# Altium schematic sheet Control_and_inputs.SchDoc: Control System - pi3 Electronic PetFeeder
size A4; DrawnBy: ByDansouza
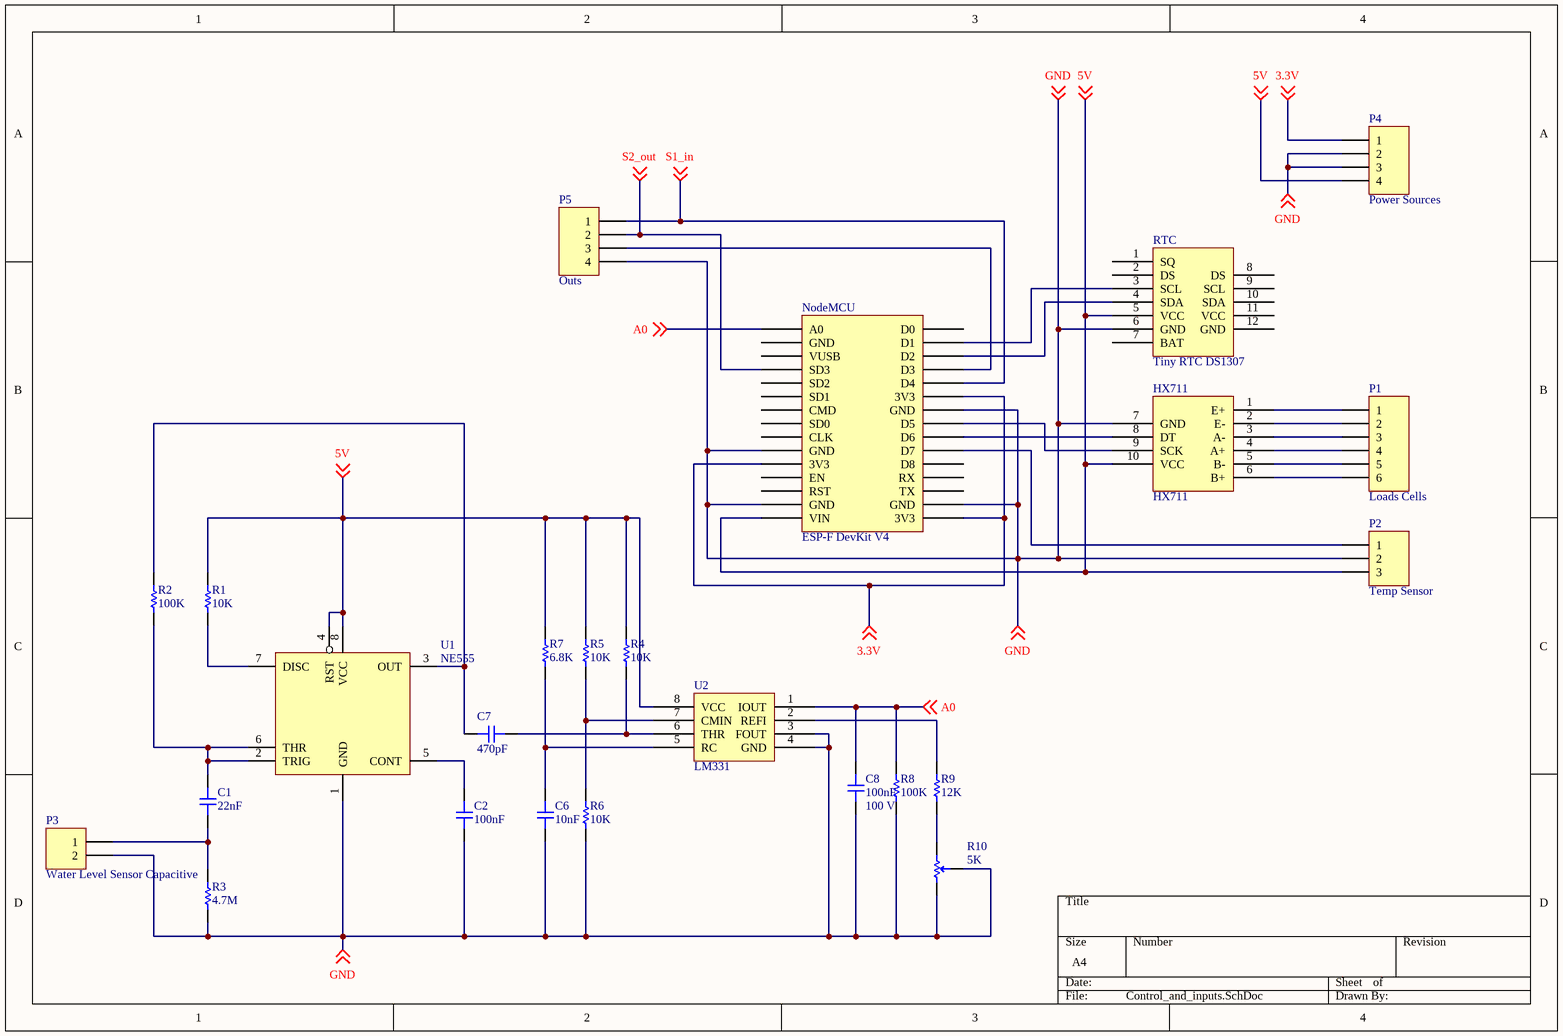
[diagram p0: Control_and_inputs.SchDoc]

## Parts
C1  22nF  [C200-350-150]
C2  100nF  [C200-350-150]
C6  10nF  [C200-350-150]
C7  470pF  [C200-350-150]
C8  100nF  Voltage: 100 V  [C200-350-150]
HX711  HX711  [HX711]
NodeMCU  ESP-F DevKit V4  [LoLin (+ NodeMCU)]
P1  Loads Cells  [KRE_6]
P2  Temp Sensor  [KRE_3]
P3  Water Level Sensor Capacitive  [KRE_2]
P4  Power Sources  [KRE_4]
P5  Outs  [KRE_4]
R1  10K  [R400-2.0mm]
R2  100K  [R400-2.0mm]
R3  4.7M  [R400-2.0mm]
R4  10K  [R400-2.0mm]
R5  10K  [R400-2.0mm]
R6  10K  [R400-2.0mm]
R7  6.8K  [R400-2.0mm]
R8  100K  [R400-2.0mm]
R9  12K  [R400-2.0mm]
R10  5K  [Trimpot-3260W]
RTC  Tiny RTC DS1307  [TinyRTC]
U1  NE555  [DIP08-300(100)]
U2  LM331  [DIP08-300(100)]

## Nets
3.3V: NodeMCU.3V3 P4.1 ; off-sheet 3.3V
5V: HX711.10(VCC) NodeMCU.VIN P2.3 P4.4 R1.2 R4.2 R5.2 R7.2 RTC.5(VCC) U1.4(RST) U1.8(VCC) U2.8(VCC) ; off-sheet 5V
A0: C8.2 NodeMCU.A0 R8.2 U2.1(IOUT) ; off-sheet A0
GND: C2.1 C6.1 C8.1 HX711.7(GND) NodeMCU.GND P2.2 P3.2 P4.2 P4.3 P5.4 R3.1 R6.1 R8.1 R10.2 R10.3 RTC.6(GND) U1.1(GND) U2.3(FOUT) U2.4(GND) ; off-sheet GND
S1_in: NodeMCU.D4 P5.1 ; off-sheet S1_in
S2_out: NodeMCU.SD3 P5.2 ; off-sheet S2_out
NetC1_1: C1.1 P3.1 R3.2
NetC1_2: C1.2 R2.1 U1.2(TRIG) U1.6(THR)
NetC2_2: C2.2 U1.5(CONT)
NetC6_2: C6.2 R7.1 U2.5(RC)
NetC7_1: C7.1 R4.1 U2.6(THR)
NetC7_2: C7.2 R2.2 U1.3(OUT)
NetHX711_1: HX711.1(E+) P1.1
NetHX711_2: HX711.2(E-) P1.2
NetHX711_3: HX711.3(A-) P1.3
NetHX711_4: HX711.4(A+) P1.4
NetHX711_5: HX711.5(B-) P1.5
NetHX711_6: HX711.6(B+) P1.6
NetHX711_8: HX711.8(DT) NodeMCU.D6
NetHX711_9: HX711.9(SCK) NodeMCU.D5
NetNodeMCU_D1: NodeMCU.D1 RTC.3(SCL)
NetNodeMCU_D2: NodeMCU.D2 RTC.4(SDA)
NetNodeMCU_D3: NodeMCU.D3 P5.3
NetNodeMCU_D7: NodeMCU.D7 P2.1
NetR1_1: R1.1 U1.7(DISC)
NetR5_1: R5.1 R6.2 U2.7(CMIN)
NetR9_1: R9.1 R10.1
NetR9_2: R9.2 U2.2(REFI)

Not connected (* = marked no-connect by the designer): NodeMCU CLK CMD D0 D8 EN RST RX SD0 SD1 SD2 TX VUSB; RTC 1(SQ) 2(DS) 7(BAT) 8(DS) 9(SCL) 10(SDA) 11(VCC) 12(GND)

## Library data of the parts
C1 C2 C6 C7 = Capacitor: Voltage: 100 V; Published: 8-Jun-2000; LatestRevisionDate: 17-Jul-2002; LatestRevisionNote: Re-released for DXP Platform.; PackageReference: RAD-0.3; Publisher: Altium Limited
C8 = Capacitor: Published: 8-Jun-2000; LatestRevisionDate: 17-Jul-2002; LatestRevisionNote: Re-released for DXP Platform.; PackageReference: RAD-0.3; Publisher: Altium Limited
NodeMCU = NodeMCU V1.0 ESP-12E_1
P1 = KRE_6: Terminal Block 1x6
P2 = KRE_3: Terminal Block 1x3
P3 = KRE_2: Terminal Block 1x2
P4 P5 = KRE_4: Terminal Block 1x4
R1-R9 = Resistor: Tolerance: 5%; Power: 1/4 W; Published: 8-Jun-2000; LatestRevisionDate: 17-Jul-2002; LatestRevisionNote: Re-released for DXP Platform.; PackageReference: AXIAL-0.3; Publisher: Altium Limited
R10 = Trimpot
U1 = NE555: NE555 Precision Timers